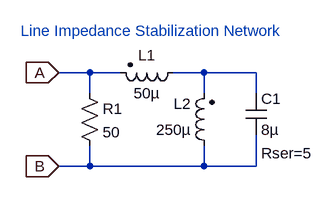
[diagram p0: schematic lisn.asc]
lisn.asc, the LTspice schematic file:
Version 4
SHEET 1 880 680
WIRE -96 304 -96 272
WIRE -96 192 -96 160
WIRE -96 160 -48 160
WIRE 32 160 80 160
WIRE 80 160 160 160
WIRE 160 160 160 192
WIRE 160 256 160 304
WIRE 160 304 80 304
WIRE 80 304 80 272
WIRE 80 192 80 160
WIRE 80 304 -96 304
WIRE -96 160 -144 160
WIRE -144 304 -96 304
FLAG -144 160 A
IOPIN -144 160 In
FLAG -144 304 B
IOPIN -144 304 In
SYMBOL res -112 176 R0
SYMATTR InstName R1
SYMATTR Value 50
SYMBOL ind2 48 144 R90
WINDOW 0 5 56 VBottom 0
WINDOW 3 32 56 VTop 0
SYMATTR InstName L1
SYMATTR Value 50µ
SYMATTR Type ind
SYMATTR SpiceLine Rser=1m
SYMBOL ind2 96 288 R180
WINDOW 0 36 80 Left 0
WINDOW 3 36 40 Left 0
SYMATTR InstName L2
SYMATTR Value 250µ
SYMATTR Type ind
SYMATTR SpiceLine Rser=1m
SYMBOL cap 144 192 R0
WINDOW 39 24 92 Left 0
SYMATTR SpiceLine Rser=5
SYMATTR InstName C1
SYMATTR Value 8µ
TEXT 0 96 Center 0 ;Line Impedance Stabilization Network

The netlist it stands for:
* lisn.asc
R1 A B 50
L1 N001 A 50µ Rser=1m
L2 B N001 250µ Rser=1m
C1 N001 B 8µ Rser=5
* Line Impedance Stabilization Network
.backanno
.end